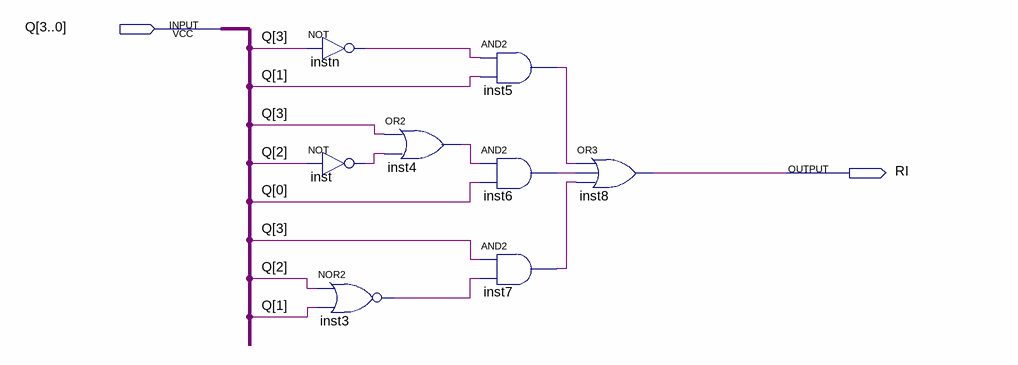
[diagram p0: schematic sheet]
// Quartus schematic RojoIzquierda.bdf as structural Verilog: 8 symbols, 2 pins
module RojoIzquierda (
  input  [3:0] Q,
  output RI
);

  wire inst3_out, inst4_out, inst5_out, inst6_out, inst7_out, inst_out, instn_out;

  not instn (instn_out, Q[3]);
  not inst (inst_out, Q[2]);
  nor inst3 (inst3_out, Q[2], Q[1]);
  or inst4 (inst4_out, Q[3], inst_out);
  and inst5 (inst5_out, instn_out, Q[1]);
  and inst6 (inst6_out, inst4_out, Q[0]);
  and inst7 (inst7_out, Q[3], inst3_out);
  or inst8 (RI, inst5_out, inst6_out, inst7_out);
endmodule
